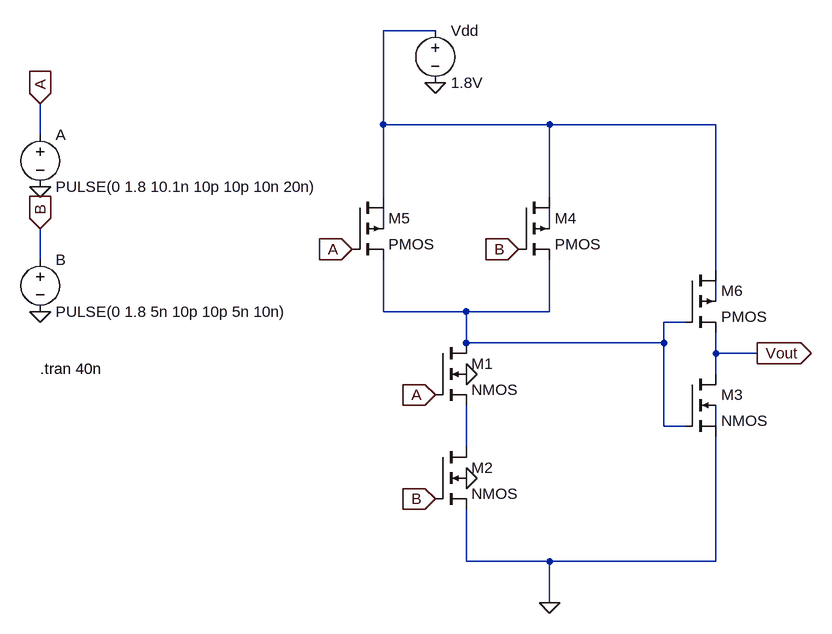
[diagram p0: schematic AND.asc]
AND.asc, the LTspice schematic file:
Version 4.1
SHEET 1 880 680
WIRE 160 -352 80 -352
WIRE 80 -208 80 -352
WIRE 336 -208 80 -208
WIRE 592 -208 336 -208
WIRE -448 -192 -448 -240
WIRE 80 -96 80 -208
WIRE 336 -96 336 -208
WIRE 80 -48 80 -80
WIRE 336 -48 336 -80
WIRE -448 0 -448 -48
WIRE 592 16 592 -208
WIRE 592 64 592 32
WIRE 80 80 80 0
WIRE 208 80 80 80
WIRE 336 80 336 0
WIRE 336 80 208 80
WIRE 544 96 512 96
WIRE 208 128 208 80
WIRE 512 128 512 96
WIRE 512 128 208 128
WIRE 592 144 592 112
WIRE 656 144 592 144
WIRE 592 176 592 144
WIRE 512 256 512 128
WIRE 544 256 512 256
WIRE 592 256 592 224
WIRE 208 288 208 224
WIRE 208 464 208 384
WIRE 336 464 208 464
WIRE 592 464 592 272
WIRE 592 464 336 464
WIRE 336 528 336 464
FLAG 336 528 0
FLAG 32 -16 A
IOPIN 32 -16 In
FLAG 160 208 A
IOPIN 160 208 In
FLAG 160 368 B
IOPIN 160 368 In
FLAG 288 -16 B
IOPIN 288 -16 In
FLAG 656 144 Vout
IOPIN 656 144 Out
FLAG -448 -112 0
FLAG -448 80 0
FLAG -448 -240 A
IOPIN -448 -240 In
FLAG -448 -48 B
IOPIN -448 -48 In
FLAG 160 -272 0
FLAG 208 336 0
FLAG 208 176 0
SYMBOL nmos4 160 128 R0
SYMATTR InstName M1
SYMATTR Value2 l=180n w=800n
SYMBOL nmos4 160 288 R0
SYMATTR InstName M2
SYMATTR Value2 l=180n w=800n
SYMBOL nmos4 544 176 R0
SYMATTR InstName M3
SYMATTR Value2 l=180n w=400n
SYMBOL pmos4 288 -96 R0
SYMATTR InstName M4
SYMATTR Value2 l=180n w=800n
SYMBOL pmos4 32 -96 R0
SYMATTR InstName M5
SYMATTR Value2 l=180n w=800n
SYMBOL pmos4 544 16 R0
SYMATTR InstName M6
SYMATTR Value2 l=180n w=800n
SYMBOL voltage 160 -368 R0
WINDOW 123 0 0 Left 0
WINDOW 39 0 0 Left 0
SYMATTR InstName Vdd
SYMATTR Value 1.8V
SYMBOL voltage -448 -208 R0
WINDOW 123 0 0 Left 0
WINDOW 39 0 0 Left 0
SYMATTR InstName A
SYMATTR Value PULSE(0 1.8 10.1n 10p 10p 10n 20n)
SYMBOL voltage -448 -16 R0
WINDOW 123 0 0 Left 0
WINDOW 39 0 0 Left 0
SYMATTR InstName B
SYMATTR Value PULSE(0 1.8 5n 10p 10p 5n 10n)
TEXT -448 168 Left 2 !.tran 40n

The netlist it stands for:
* AND.asc
M1 N005 A N007 0 NMOS l=180n w=800n
M2 N007 B 0 0 NMOS l=180n w=800n
M3 Vout N005 0 N006 NMOS l=180n w=400n
M4 N001 B N005 N003 PMOS l=180n w=800n
M5 N001 A N005 N002 PMOS l=180n w=800n
M6 N001 N005 Vout N004 PMOS l=180n w=800n
Vdd N001 0 1.8V
V§A A 0 PULSE(0 1.8 10.1n 10p 10p 10n 20n)
V§B B 0 PULSE(0 1.8 5n 10p 10p 5n 10n)
.model NMOS NMOS
.model PMOS PMOS
.lib standard.mos
.tran 40n
.backanno
.end